# Altium schematic sheet Fri3D_IRA_Peripherals.SchDoc: Peripherals
size A3; Date: 25/03/2024; DrawnBy: Wim Van Gool; DocumentNumber: 3; Revision: 02; SheetNumber: 3; SheetTotal: 4
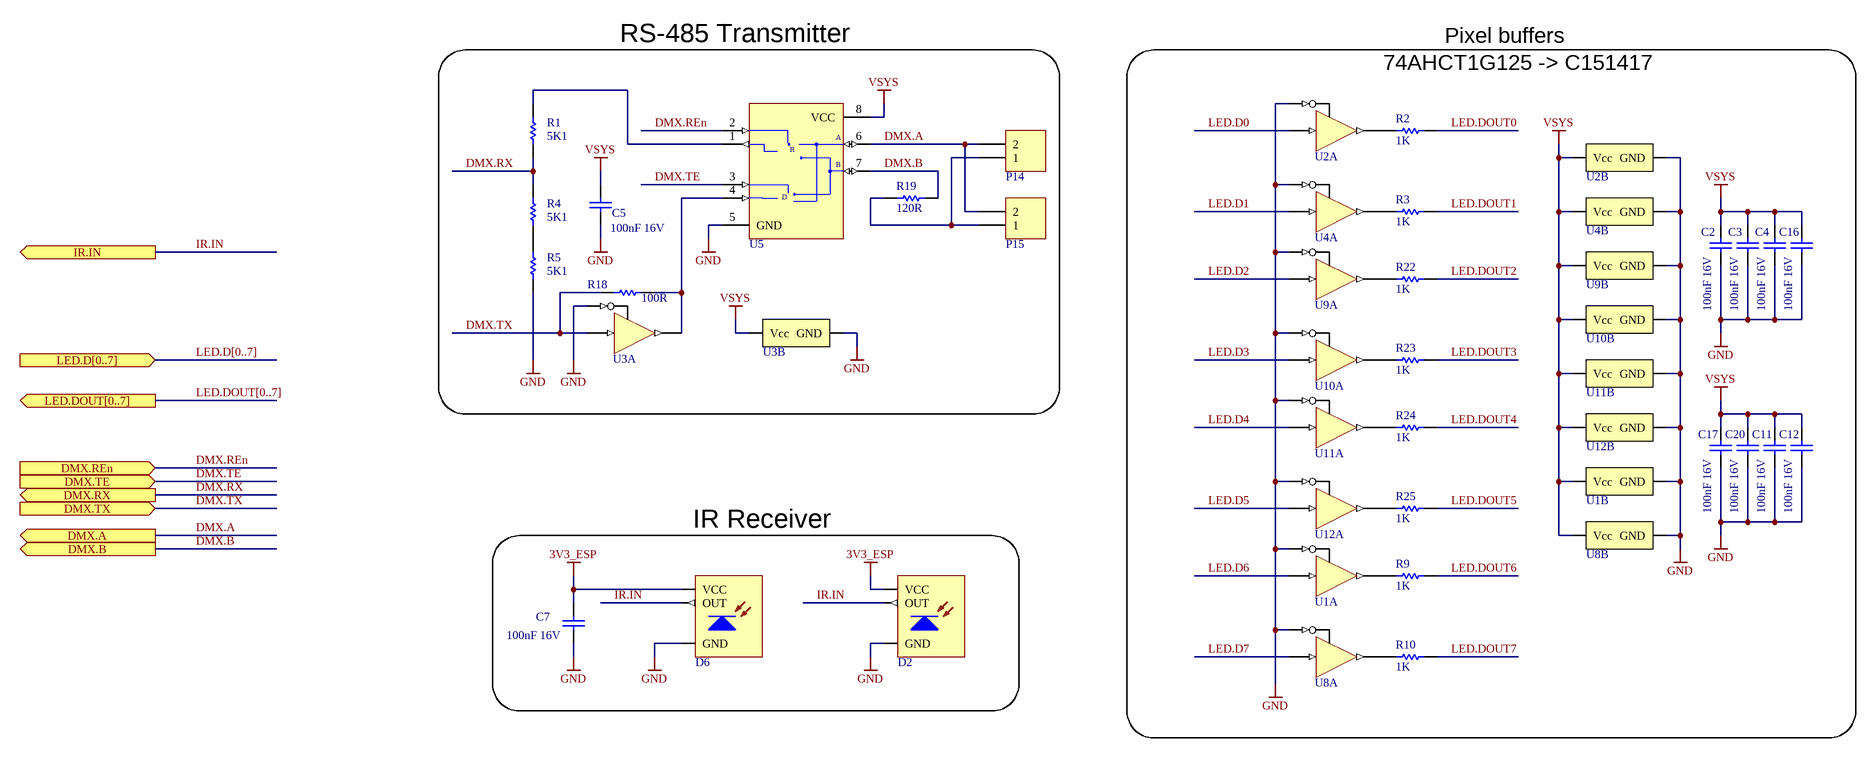
[diagram p0: Fri3D_IRA_Peripherals.SchDoc]

## Parts
C2  value 100nF 16V  [C0603_N]
C3  value 100nF 16V  [C0603_N]
C4  value 100nF 16V  [C0603_N]
C5  value 100nF 16V  [C0603_N]
C7  value 100nF 16V  [C0603_N]
C11  value 100nF 16V  [C0603_N]
C12  value 100nF 16V  [C0603_N]
C16  value 100nF 16V  [C0603_N]
C17  value 100nF 16V  [C0603_N]
C20  value 100nF 16V  [C0603_N]
D2  ZIRM-5042B-42-Z2 Infrared Receiver 38 kHz 45° 2.7-5.5V 940nm  [CHAU_ZIRM-5042B-42-Z2]  (value not drawn)
D6  IRM-3638N3F14 Infrared Receiver 38 kHz 45° 2.7-5.5V  [VIS_TSOP381x_BENT]  (value not drawn)
P14  Easy to solder connection  [SOLDER_SW_V_1MM]  (value not drawn)
P15  Header 2  [HDR1X2]  (value not drawn)
R1  value 5K1  [R0603_N]
R2  value 1K  [R0603_N]
R3  value 1K  [R0603_N]
R4  value 5K1  [R0603_N]
R5  value 5K1  [R0603_N]
R9  value 1K  [R0603_N]
R10  value 1K  [R0603_N]
R18  value 100R  [R0603_N]
R19  value 120R  [R1206]
R22  value 1K  [R0603_N]
R23  value 1K  [R0603_N]
R24  value 1K  [R0603_N]
R25  value 1K  [R0603_N]
U1  SN74AHCT1G125DCKR  Buffer, Tri-State, 4.5V to 5.5V  [TI_DCK_R-PDSO-G5]  (value not drawn)  (parts A,B of 2)
U2  SN74AHCT1G125DCKR  Buffer, Tri-State, 4.5V to 5.5V  [TI_DCK_R-PDSO-G5]  (value not drawn)  (parts A,B of 2)
U3  SN74AHCT1G125DCKR  Buffer, Tri-State, 4.5V to 5.5V  [TI_DCK_R-PDSO-G5]  (value not drawn)  (parts A,B of 2)
U4  SN74AHCT1G125DCKR  Buffer, Tri-State, 4.5V to 5.5V  [TI_DCK_R-PDSO-G5]  (value not drawn)  (parts A,B of 2)
U5  RS-485 5V Transceiver 500kbps  [SOIC_N_8]  (value not drawn)
U8  SN74AHCT1G125DCKR  Buffer, Tri-State, 4.5V to 5.5V  [TI_DCK_R-PDSO-G5]  (value not drawn)  (parts A,B of 2)
U9  SN74AHCT1G125DCKR  Buffer, Tri-State, 4.5V to 5.5V  [TI_DCK_R-PDSO-G5]  (value not drawn)  (parts A,B of 2)
U10  SN74AHCT1G125DCKR  Buffer, Tri-State, 4.5V to 5.5V  [TI_DCK_R-PDSO-G5]  (value not drawn)  (parts A,B of 2)
U11  SN74AHCT1G125DCKR  Buffer, Tri-State, 4.5V to 5.5V  [TI_DCK_R-PDSO-G5]  (value not drawn)  (parts A,B of 2)
U12  SN74AHCT1G125DCKR  Buffer, Tri-State, 4.5V to 5.5V  [TI_DCK_R-PDSO-G5]  (value not drawn)  (parts A,B of 2)

## Blocks framed on the sheet
RS-485 Transmitter: C5 P14 P15 R1 R4 R5 R18 R19 U3 U5
IR Receiver: C7 D2 D6

## Ports
DMX.A (out), DMX.B (out), DMX.REn (in), DMX.RX (out), DMX.TE (in), DMX.TX (in), IR.IN (out), LED.D[0..7] (in), LED.DOUT[0..7] (out)

## Nets
3V3_ESP: C7.1 D2.3(VCC) D6.3(VCC)
GND: C2.2 C3.2 C4.2 C5.2 C7.2 C11.2 C12.2 C16.2 C17.2 C20.2 D2.2(GND) D6.2(GND) R5.2 U1.1(~{OE}) U1.3(GND) U2.1(~{OE}) U2.3(GND) U3.1(~{OE}) U3.3(GND) U4.1(~{OE}) U4.3(GND) U5.5(GND) U8.1(~{OE}) U8.3(GND) U9.1(~{OE}) U9.3(GND) U10.1(~{OE}) U10.3(GND) U11.1(~{OE}) U11.3(GND) U12.1(~{OE}) U12.3(GND)
VSYS: C2.1 C3.1 C4.1 C5.1 C11.1 C12.1 C16.1 C17.1 C20.1 U1.5(Vcc) U2.5(Vcc) U3.5(Vcc) U4.5(Vcc) U5.8(VCC) U8.5(Vcc) U9.5(Vcc) U10.5(Vcc) U11.5(Vcc) U12.5(Vcc)
DMX.A: P14.2 P15.2 U5.6(A) ; port DMX.A
DMX.B: R19.2 U5.7(B) ; port DMX.B
DMX.REn: U5.2(~{RE}) ; port DMX.REn
DMX.RX: R1.2 R4.1 ; port DMX.RX
DMX.TE: U5.3(DE) ; port DMX.TE
DMX.TX: R18.1 U3.2(A) ; port DMX.TX
IR.IN: D2.1(OUT) D6.1(OUT) ; port IR.IN
LED.D0: U2.2(A)
LED.D1: U4.2(A)
LED.D2: U9.2(A)
LED.D3: U10.2(A)
LED.D4: U11.2(A)
LED.D5: U12.2(A)
LED.D6: U1.2(A)
LED.D7: U8.2(A)
LED.DOUT0: R2.2
LED.DOUT1: R3.2
LED.DOUT2: R22.2
LED.DOUT3: R23.2
LED.DOUT4: R24.2
LED.DOUT5: R25.2
LED.DOUT6: R9.2
LED.DOUT7: R10.2
NetP14_1: P14.1 P15.1 R19.1
NetR1_1: R1.1 U5.1(RO)
NetR2_1: R2.1 U2.4(Y)
NetR3_1: R3.1 U4.4(Y)
NetR4_2: R4.2 R5.1
NetR9_1: R9.1 U1.4(Y)
NetR10_1: R10.1 U8.4(Y)
NetR18_2: R18.2 U3.4(Y) U5.4(DI)
NetR22_1: R22.1 U9.4(Y)
NetR23_1: R23.1 U10.4(Y)
NetR24_1: R24.1 U11.4(Y)
NetR25_1: R25.1 U12.4(Y)

## Buses and harness runs
bus LED.D[0..7] = port LED.D[0..7]
bus LED.DOUT[0..7] = port LED.DOUT[0..7]

## Notes on the sheet
- Pixel buffers
- 74AHCT1G125 -> C151417
- Title
- Revision
- Date
- Dranw By
- Size
- A3
- Sheet
- of
- (in symbol WS3085 # RS-485 transceiver) R; D

## Library data of the parts
C2-C5 C7 C11 C12 C16 C17 C20 = CAP # 100nF 16V 0603: Capacitor Ceramic; Supplier 1: LCSC; Supplier 3: Generic; Supplier Part Number 1: C282519; Supplier Part Number 3: 100nF 16V 0603 X7R
D2 = PHO IR Rx 940nm ZIRM-5042B-42-Z2: =Description; Value: ZIRM-5042B-42-Z2; Supplier 1: LCSC; Supplier Part Number 1: C575386
D6 = PHO IR Rx RA: =Description; Value: IRM-3638N3F14; Supplier 1: LCSC; Supplier Part Number 1: C264262
P14 = SOLDER SW V 1MM: Value: NO BOM
P15 = Pin Header 2.54mm 2way: Supplier 1: LCSC; Supplier 2: LCSC; Supplier Part Number 1: C492401; Supplier Part Number 2: C541856
R1 R4 R5 = RES # 5K1 0603: Supplier 1: Farnell; Supplier Part Number 1: 2845922; Supplier 2: LCSC; Supplier 3: Generic; Supplier Part Number 2: C112314; Supplier Part Number 3: 5K1 1% 0603
R2 R3 R9 R10 R22-R25 = RES # 1K 0603: Supplier 1: Farnell; Supplier Part Number 1: 2689409; Supplier 2: LCSC; Supplier Part Number 2: C21190; Supplier 3: Generic; Supplier Part Number 3: 1K 1% 0603
R18 = RES # 100R 0603: Supplier 1: Farnell; Supplier 2: LCSC; Supplier 3: Generic; Supplier Part Number 1: 2446544; Supplier Part Number 2: C22775; Supplier Part Number 3: 100R 1% 0603
R19 = RES # 120R 1206: Supplier 3: Generic; Supplier Part Number 3: 120R 1% 1206; Supplier 1: LCSC; Supplier Part Number 1: C17909
U1-U4 U8-U12 = BUF # 1 SN74AHCT1G125DCKR: =Description; Value: SN74AHCT1G125DCKR; Supplier 1: LCSC; Supplier Part Number 1: C151417; Supplier 2: LCSC; Supplier Part Number 2: C350557
U5 = WS3085 # RS-485 transceiver: Value: WS3085; Supplier 1: LCSC; Supplier Part Number 1: C2691412; Description: WS3085 # RS-485 transceiver